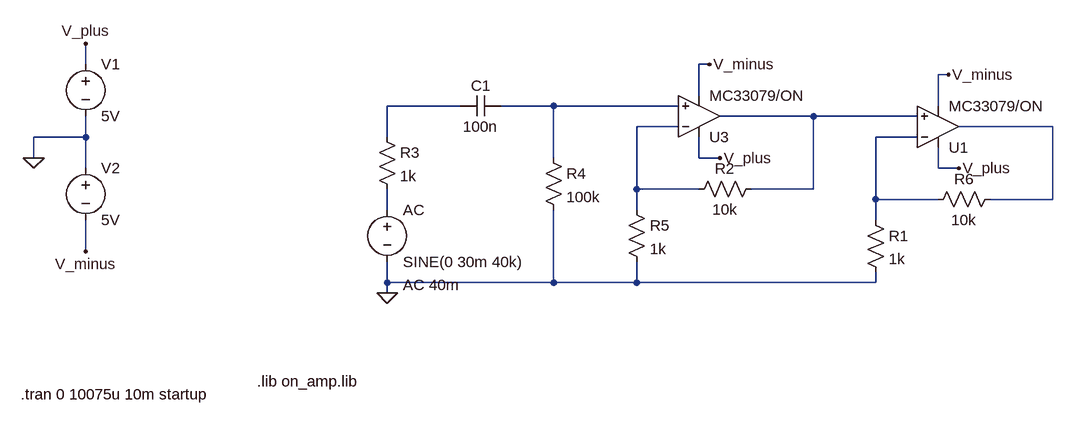
[diagram p0: schematic opamp_rec.asc]
opamp_rec.asc, the LTspice schematic file:
Version 4
SHEET 1 880 680
WIRE -640 80 -640 48
WIRE 320 80 304 80
WIRE 688 96 672 96
WIRE 304 128 304 80
WIRE -64 144 -176 144
WIRE 80 144 0 144
WIRE 272 144 80 144
WIRE 672 144 672 96
WIRE 480 160 336 160
WIRE 640 160 480 160
WIRE 272 176 208 176
WIRE 848 176 704 176
WIRE -640 192 -640 160
WIRE -640 192 -720 192
WIRE -176 192 -176 144
WIRE 640 192 576 192
WIRE -720 224 -720 192
WIRE 80 224 80 144
WIRE 304 224 304 192
WIRE 336 224 304 224
WIRE -640 240 -640 192
WIRE 672 240 672 208
WIRE 704 240 672 240
WIRE 208 272 208 176
WIRE 304 272 208 272
WIRE 480 272 480 160
WIRE 480 272 384 272
WIRE 576 288 576 192
WIRE 672 288 576 288
WIRE 848 288 848 176
WIRE 848 288 752 288
WIRE -176 304 -176 272
WIRE 208 304 208 272
WIRE 576 320 576 288
WIRE -640 368 -640 320
WIRE -176 416 -176 384
WIRE 80 416 80 304
WIRE 80 416 -176 416
WIRE 208 416 208 384
WIRE 208 416 80 416
WIRE 576 416 576 400
WIRE 576 416 208 416
WIRE -176 432 -176 416
FLAG -720 224 0
FLAG -640 48 V_plus
FLAG -640 368 V_minus
FLAG -176 432 0
FLAG 320 80 V_minus
FLAG 336 224 V_plus
FLAG 688 96 V_minus
FLAG 704 240 V_plus
SYMBOL voltage -640 64 R0
WINDOW 123 0 0 Left 0
WINDOW 39 0 0 Left 0
SYMATTR InstName V1
SYMATTR Value 5V
SYMBOL voltage -640 224 R0
WINDOW 123 0 0 Left 0
WINDOW 39 0 0 Left 0
SYMATTR InstName V2
SYMATTR Value 5V
SYMBOL voltage -176 288 R0
WINDOW 123 24 132 Left 0
WINDOW 39 0 0 Left 0
SYMATTR InstName AC
SYMATTR Value SINE(0 30m 40k)
SYMATTR Value2 AC 40m
SYMBOL res -192 176 R0
SYMATTR InstName R3
SYMATTR Value 1k
SYMBOL Opamps\\opamp2 304 224 M180
SYMATTR InstName U3
SYMATTR Value MC33079/ON
SYMBOL cap 0 128 R90
WINDOW 0 0 32 VBottom 0
WINDOW 3 32 32 VTop 0
SYMATTR InstName C1
SYMATTR Value 100n
SYMBOL res 64 208 R0
SYMATTR InstName R4
SYMATTR Value 100k
SYMBOL res 192 288 R0
SYMATTR InstName R5
SYMATTR Value 1k
SYMBOL res 400 256 R90
WINDOW 0 0 56 VBottom 0
WINDOW 3 32 56 VTop 0
SYMATTR InstName R2
SYMATTR Value 10k
SYMBOL Opamps\\opamp2 672 240 M180
SYMATTR InstName U1
SYMATTR Value MC33079/ON
SYMBOL res 560 304 R0
SYMATTR InstName R1
SYMATTR Value 1k
SYMBOL res 768 272 R90
WINDOW 0 0 56 VBottom 0
WINDOW 3 32 56 VTop 0
SYMATTR InstName R6
SYMATTR Value 10k
TEXT -376 568 Left 0 !.lib on_amp.lib
TEXT -740 588 Left 0 !.tran 0 10075u 10m startup

The netlist it stands for:
* opamp_rec.asc
V1 V_plus 0 5V
V2 0 V_minus 5V
V§AC N007 0 SINE(0 30m 40k) AC 40m
R3 N001 N007 1k
XU3 N002 N004 V_plus V_minus N003 MC33079/ON  ; pins In+ In- V+ V- OUT
C1 N002 N001 100n
R4 N002 0 100k
R5 N004 0 1k
R2 N003 N004 10k
XU1 N003 N006 V_plus V_minus N005 MC33079/ON  ; pins In+ In- V+ V- OUT
R1 N006 0 1k
R6 N005 N006 10k
.lib on_amp.lib
.tran 0 10075u 10m startup
.backanno
.end